# Altium project CCZynq.PrjPCB (part 2 of 4)

## Sheet ZYNQ_DDR3.SchDoc: DDR3
size 431 x 279 mm
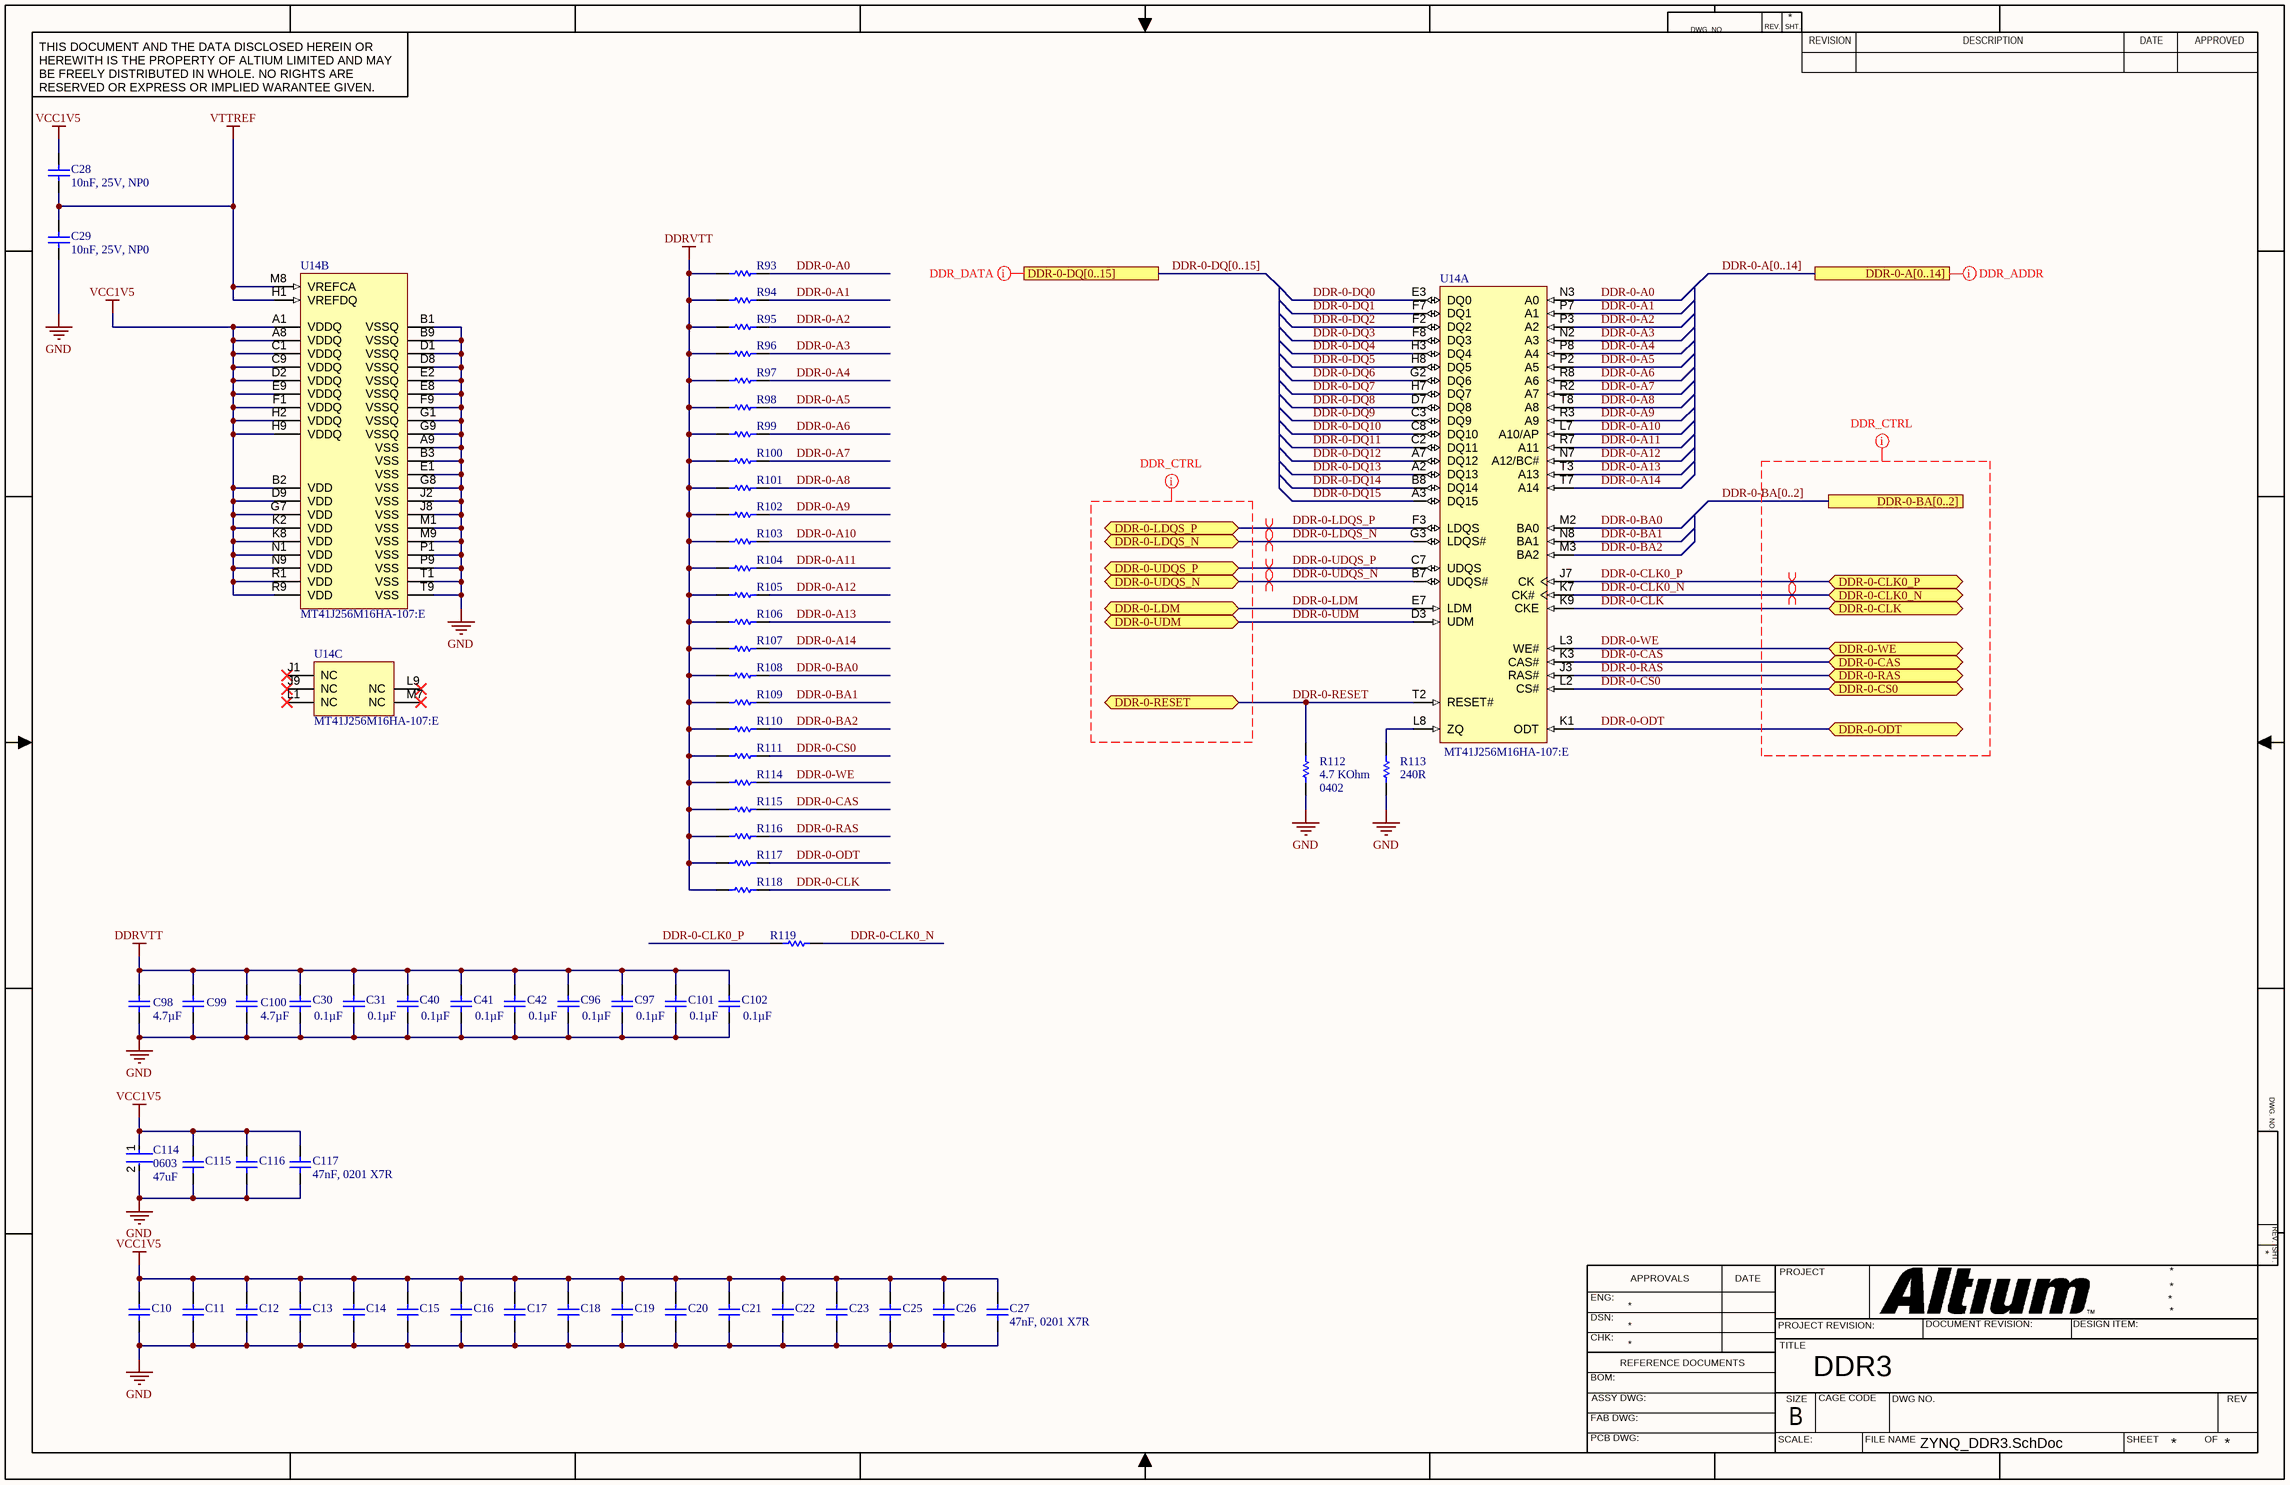
[diagram p4: ZYNQ_DDR3.SchDoc]

### Parts
C10  (no value)  [CAP0201i]
C11  (no value)  [CAP0201i]
C12  (no value)  [CAP0201i]
C13  (no value)  [CAP0201i]
C14  (no value)  [CAP0201i]
C15  (no value)  [CAP0201i]
C16  (no value)  [CAP0201i]
C17  (no value)  [CAP0201i]
C18  (no value)  [CAP0201i]
C19  (no value)  [CAP0201i]
C20  (no value)  [CAP0201i]
C21  (no value)  [CAP0201i]
C22  (no value)  [CAP0201i]
C23  (no value)  [CAP0201i]
C25  (no value)  [CAP0201i]
C26  (no value)  [CAP0201i]
C27  value 47nF, 0201 X7R  [CAP0201i]
C28  value 10nF, 25V, NP0  [CAP0402i]  (hidden comment: 10nF)
C29  value 10nF, 25V, NP0  [CAP0402i]  (hidden comment: 10nF)
C30  0.1µF  [CAP0402i]
C31  0.1µF  [CAP0402i]
C40  0.1µF  [CAP0402i]
C41  0.1µF  [CAP0402i]
C42  0.1µF  [CAP0402i]
C96  0.1µF  [CAP0402i]
C97  0.1µF  [CAP0402i]
C98  4.7µF  [CAP0402i]
C99  4.7µF  [CAP0402i]  (value not drawn)
C100  4.7µF  [CAP0402i]
C101  0.1µF  [CAP0402i]
C102  0.1µF  [CAP0402i]
C114  Case Code (Imperial): 0603  Capacitance: 47uF  [FP-GRM188-0_2-IPC_B]  (hidden comment: GRM188R60J476ME15D)
C115  4.7µF  [CAP0402i]  (value not drawn)
C116  (no value)  [CAP0201i]
C117  value 47nF, 0201 X7R  [CAP0201i]
R93  ERJ2RKF33R0X  [RESC1005X40X25LL05T05]  (value not drawn)
R94  ERJ2RKF33R0X  [RESC1005X40X25LL05T05]  (value not drawn)
R95  ERJ2RKF33R0X  [RESC1005X40X25LL05T05]  (value not drawn)
R96  ERJ2RKF33R0X  [RESC1005X40X25LL05T05]  (value not drawn)
R97  ERJ2RKF33R0X  [RESC1005X40X25LL05T05]  (value not drawn)
R98  ERJ2RKF33R0X  [RESC1005X40X25LL05T05]  (value not drawn)
R99  ERJ2RKF33R0X  [RESC1005X40X25LL05T05]  (value not drawn)
R100  ERJ2RKF33R0X  [RESC1005X40X25LL05T05]  (value not drawn)
R101  ERJ2RKF33R0X  [RESC1005X40X25LL05T05]  (value not drawn)
R102  ERJ2RKF33R0X  [RESC1005X40X25LL05T05]  (value not drawn)
R103  ERJ2RKF33R0X  [RESC1005X40X25LL05T05]  (value not drawn)
R104  ERJ2RKF33R0X  [RESC1005X40X25LL05T05]  (value not drawn)
R105  ERJ2RKF33R0X  [RESC1005X40X25LL05T05]  (value not drawn)
R106  ERJ2RKF33R0X  [RESC1005X40X25LL05T05]  (value not drawn)
R107  ERJ2RKF33R0X  [RESC1005X40X25LL05T05]  (value not drawn)
R108  ERJ2RKF33R0X  [RESC1005X40X25LL05T05]  (value not drawn)
R109  ERJ2RKF33R0X  [RESC1005X40X25LL05T05]  (value not drawn)
R110  ERJ2RKF33R0X  [RESC1005X40X25LL05T05]  (value not drawn)
R111  ERJ2RKF33R0X  [RESC1005X40X25LL05T05]  (value not drawn)
R112  Resistance: 4.7 KOhm  PackageReference: 0402  [RESC1005X40X25LL05T05]  (hidden comment: ERJ-2RKF4701X)
R113  value 240R  [RESC1005X40X25ML05T05]  (hidden comment: CRCW0402240RFKED)
R114  ERJ2RKF33R0X  [RESC1005X40X25LL05T05]  (value not drawn)
R115  ERJ2RKF33R0X  [RESC1005X40X25LL05T05]  (value not drawn)
R116  ERJ2RKF33R0X  [RESC1005X40X25LL05T05]  (value not drawn)
R117  ERJ2RKF33R0X  [RESC1005X40X25LL05T05]  (value not drawn)
R118  ERJ2RKF33R0X  [RESC1005X40X25LL05T05]  (value not drawn)
R119  CRCW040282R0FKED  [RESC1005X40X25NL05T05]  (value not drawn)
U14  MT41J256M16HA-107:E  [MICT-HA-96]  (parts A,B,C of 3)

### Ports
DDR-0-A[0..14], DDR-0-BA[0..2], DDR-0-CAS (bidir), DDR-0-CLK0_N (bidir), DDR-0-CLK0_P (bidir), DDR-0-CLK (bidir), DDR-0-CS0 (bidir), DDR-0-DQ[0..15], DDR-0-LDM (bidir), DDR-0-LDQS_N (bidir), DDR-0-LDQS_P (bidir), DDR-0-ODT (bidir), DDR-0-RAS (bidir), DDR-0-RESET (bidir), DDR-0-UDM (bidir), DDR-0-UDQS_N (bidir), DDR-0-UDQS_P (bidir), DDR-0-WE (bidir)

### Nets
DDRVTT: C30.2 C31.2 C40.2 C41.2 C42.2 C96.2 C97.2 C98.2 C99.2 C100.2 C101.2 C102.2 R93.1 R94.1 R95.1 R96.1 R97.1 R98.1 R99.1 R100.1 R101.1 R102.1 R103.1 R104.1 R105.1 R106.1 R107.1 R108.1 R109.1 R110.1 R111.1 R114.1 R115.1 R116.1 R117.1 R118.1
GND: C10.1 C11.1 C12.1 C13.1 C14.1 C15.1 C16.1 C17.1 C18.1 C19.1 C20.1 C21.1 C22.1 C23.1 C25.1 C26.1 C27.1 C29.1 C30.1 C31.1 C40.1 C41.1 C42.1 C96.1 C97.1 C98.1 C99.1 C100.1 C101.1 C102.1 C114.2 C115.1 C116.1 C117.2 R112.1 R113.1 U14.A9(VSS) U14.B1(VSSQ) U14.B3(VSS) U14.B9(VSSQ) U14.D1(VSSQ) U14.D8(VSSQ) U14.E1(VSS) U14.E2(VSSQ) U14.E8(VSSQ) U14.F9(VSSQ) U14.G1(VSSQ) U14.G8(VSS) U14.G9(VSSQ) U14.J2(VSS) U14.J8(VSS) U14.M1(VSS) U14.M9(VSS) U14.P1(VSS) U14.P9(VSS) U14.T1(VSS) U14.T9(VSS)
VCC1V5: C10.2 C11.2 C12.2 C13.2 C14.2 C15.2 C16.2 C17.2 C18.2 C19.2 C20.2 C21.2 C22.2 C23.2 C25.2 C26.2 C27.2 C28.2 C114.1 C115.2 C116.2 C117.1 U14.A1(VDDQ) U14.A8(VDDQ) U14.B2(VDD) U14.C1(VDDQ) U14.C9(VDDQ) U14.D2(VDDQ) U14.D9(VDD) U14.E9(VDDQ) U14.F1(VDDQ) U14.G7(VDD) U14.H2(VDDQ) U14.H9(VDDQ) U14.K2(VDD) U14.K8(VDD) U14.N1(VDD) U14.N9(VDD) U14.R1(VDD) U14.R9(VDD)
VTTREF: C28.1 C29.2 U14.H1(VREFDQ) U14.M8(VREFCA)
DDR-0-A0: R93.2 U14.N3(A0)
DDR-0-A1: R94.2 U14.P7(A1)
DDR-0-A2: R95.2 U14.P3(A2)
DDR-0-A3: R96.2 U14.N2(A3)
DDR-0-A4: R97.2 U14.P8(A4)
DDR-0-A5: R98.2 U14.P2(A5)
DDR-0-A6: R99.2 U14.R8(A6)
DDR-0-A7: R100.2 U14.R2(A7)
DDR-0-A8: R101.2 U14.T8(A8)
DDR-0-A9: R102.2 U14.R3(A9)
DDR-0-A10: R103.2 U14.L7(A10/AP)
DDR-0-A11: R104.2 U14.R7(A11)
DDR-0-A12: R105.2 U14.N7(A12/BC#)
DDR-0-A13: R106.2 U14.T3(A13)
DDR-0-A14: R107.2 U14.T7(A14)
DDR-0-BA0: R108.2 U14.M2(BA0)
DDR-0-BA1: R109.2 U14.N8(BA1)
DDR-0-BA2: R110.2 U14.M3(BA2)
DDR-0-CAS: R115.2 U14.K3(CAS#) ; port DDR-0-CAS
DDR-0-CLK: R118.2 U14.K9(CKE) ; port DDR-0-CLK
DDR-0-CLK0_N: R119.2 U14.K7(CK#) ; port DDR-0-CLK0_N
DDR-0-CLK0_P: R119.1 U14.J7(CK) ; port DDR-0-CLK0_P
DDR-0-CS0: R111.2 U14.L2(CS#) ; port DDR-0-CS0
DDR-0-DQ0: U14.E3(DQ0)
DDR-0-DQ1: U14.F7(DQ1)
DDR-0-DQ2: U14.F2(DQ2)
DDR-0-DQ3: U14.F8(DQ3)
DDR-0-DQ4: U14.H3(DQ4)
DDR-0-DQ5: U14.H8(DQ5)
DDR-0-DQ6: U14.G2(DQ6)
DDR-0-DQ7: U14.H7(DQ7)
DDR-0-DQ8: U14.D7(DQ8)
DDR-0-DQ9: U14.C3(DQ9)
DDR-0-DQ10: U14.C8(DQ10)
DDR-0-DQ11: U14.C2(DQ11)
DDR-0-DQ12: U14.A7(DQ12)
DDR-0-DQ13: U14.A2(DQ13)
DDR-0-DQ14: U14.B8(DQ14)
DDR-0-DQ15: U14.A3(DQ15)
DDR-0-LDM: U14.E7(LDM) ; port DDR-0-LDM
DDR-0-LDQS_N: U14.G3(LDQS#) ; port DDR-0-LDQS_N
DDR-0-LDQS_P: U14.F3(LDQS) ; port DDR-0-LDQS_P
DDR-0-ODT: R117.2 U14.K1(ODT) ; port DDR-0-ODT
DDR-0-RAS: R116.2 U14.J3(RAS#) ; port DDR-0-RAS
DDR-0-RESET: R112.2 U14.T2(RESET#) ; port DDR-0-RESET
DDR-0-UDM: U14.D3(UDM) ; port DDR-0-UDM
DDR-0-UDQS_N: U14.B7(UDQS#) ; port DDR-0-UDQS_N
DDR-0-UDQS_P: U14.C7(UDQS) ; port DDR-0-UDQS_P
DDR-0-WE: R114.2 U14.L3(WE#) ; port DDR-0-WE
NetR113_2: R113.2 U14.L8(ZQ)

Not connected (* = marked no-connect by the designer): U14 J1(NC)* J9(NC)* L1(NC)* L9(NC)* M7(NC)*

### Buses and harness runs
bus DDR-0-A[0..14] = port DDR-0-A[0..14]
bus DDR-0-BA[0..2] = port DDR-0-BA[0..2]
bus DDR-0-DQ[0..15] = port DDR-0-DQ[0..15]

### Layout directives
differential pair: DDR-0-CLK0_N, DDR-0-CLK0_P, DDR-0-LDQS_N, DDR-0-LDQS_P, DDR-0-UDQS_N, DDR-0-UDQS_P
net class DDR_DATA; rule Width Constraint [Pref Width = 0.1mm    Min Width = 0.1mm    Max Width = 0.254mm]; rule Impedance Constraint [Min = 49.99    Max = 50.00    ]: (no net found under the mark)
net class DDR_CTRL; rule Width Constraint [Pref Width = 0.1mm    Min Width = 0.1mm    Max Width = 0.254mm]; rule Impedance Constraint [Min = 49.99    Max = 50.99    ]; rule Length Constraint [Min Length = 0mil    Max Length = 2000mil]: (no net found under the mark)

### Notes on the sheet
- DWG. NO.
- REV.
- SHT.
- THIS DOCUMENT AND THE DATA DISCLOSED HEREIN OR HEREWITH IS THE PROPERTY OF ALTIUM LIMITED AND MAY BE FREELY DISTRIBUTED IN WHOLE. NO RIGHTS ARE RESERVED OR EXPRESS OR IMPLIED WARANTEE GIVEN.
- REVISION
- DESCRIPTION
- DATE
- APPROVED
- ENG:
- APPROVALS
- PROJECT
- DSN:
- CHK:
- REFERENCE DOCUMENTS
- PROJECT REVISION:
- TITLE
- DOCUMENT REVISION:
- DESIGN ITEM:
- BOM:
- FAB DWG:
- PCB DWG:
- ASSY DWG:
- SCALE:
- SIZE
- B
- CAGE CODE
- FILE NAME
- DWG NO.
- SHEET
- OF
- REV

### Library data of the parts
C10-C23 C25 C26 C116 = Cap_47nF_X7R_0201: 0201, 47nF, 10%, 25V, X7R; Value: 47nF, 0201 X7R; Mounting Type: SMT; Package: 0201; Applications: Automotive; Ratings: AEC-Q200; Component Type: Generic; Capacitance: 47nF; Note: *; Supplier 1: Arrow Electronics; Supplier Part Number 1: GRM033R61A473KE84D; Supplier 2: Future Electronics; Supplier Part Number 2: 4125905; Supplier 3: Farnell; Supplier Part Number 3: 3340765; Supplier 4: Mouser; Supplier Part Number 4: 81-GRM033R61A473KE4D; Supplier 5: Digikey; Supplier Part Number 5: 490-14570-1-ND; Supplier 6: Newark; Supplier Part Number 6: 77AH4496
C27 C117 = Cap_47nF_X7R_0201: 0201, 47nF, 10%, 25V, X7R; Mounting Type: SMT; Package: 0201; Applications: Automotive; Ratings: AEC-Q200; Component Type: Generic; Capacitance: 47nF; Note: *; Supplier 1: Arrow Electronics; Supplier Part Number 1: GRM033R61A473KE84D; Supplier 2: Future Electronics; Supplier Part Number 2: 4125905; Supplier 3: Farnell; Supplier Part Number 3: 3340765; Supplier 4: Mouser; Supplier Part Number 4: 81-GRM033R61A473KE4D; Supplier 5: Digikey; Supplier Part Number 5: 490-14570-1-ND; Supplier 6: Newark; Supplier Part Number 6: 77AH4496
C28 C29 = Cap_10nF_25V_NP0_0402: 0402,10nF,5%,25V,NP0; Part Number: GRM1555C1E103JE01J; Manufacturer: Murata; Type: Ceramic; Voltage: 25V; Temperature Coefficient: NP0; Tolerance: ±5%; Operating Temperature: -55°C ~ 125°C; Mounting Type: SMT; Package: 0402 (1005 Metric); Supplier 1: Mouser; Supplier Part Number 1: 81-GRM1555C1E103JE1J; Manufacturer Part Number 1: GRM1555C1E103JE01J; Component Type: Generic; Capacitance: 10nF; Note: *; Supplier 2: DigiKey; Supplier 3: Farnell; Supplier Part Number 2: *; Supplier Part Number 3: *
C30 C31 C40-C42 C96 C97 C101 C102 = Cap_0.1uF_50V_X7R_0402: 0402, 0.1uF, 10%,  50V, X7R; Part Number: C1005X7R1H104K050BE; Manufacturer 1: TDK; Type: Ceramic; Value: 0.1µF,50V,X7R; Voltage: 50V; Temperature Coefficient: X7R; Tolerance: ±10%; Operating Temperature: -55°C ~ 125°C; Mounting Type: SMT; Package: 0402 (1005 Metric); Applications: Automotive; Ratings: AEC-Q200; Supplier 1: Mouser; Supplier Part Number 1: 810-C1005X7R1H104KBE; Manufacturer Part Number 1: C1005X7R1H104K050BE; Component Type: Generic; Capacitance: 0.1µF; Note: *; Supplier 2: DigiKey; Supplier 3: Farnell; Supplier Part Number 2: 445-173610-1-ND; Supplier Part Number 3: 3416071
C98-C100 C115 = Cap_4.7uF_10V_10%_0402: CAP CER 4.7UF 10V X5R 0402; Part Number: C1005X5R1A475K050BC; Manufacturer 1: TDK; Value: 4.7µF, 10V, X5R; Tolerance: 10%; Dielectric Material: Ceramic; RoHS: Yes; Lead Free: Lead Free; ComponentLink2Description: https://datasheet.ciiva.com/14895/tdkmlcccaprange-14895670.pdf?src-supplier=Digi-Key; ComponentLink2URL: https://datasheet.ciiva.com/14895/tdkmlcccaprange-14895670.pdf?src-supplier=Digi-Key; Category: Ceramic Capacitors; Capacitance: 4.7µF; Voltage Rating: 10V; Supplier 1: Mouser; Manufacturer Part Number 1: C1005X5R1A475K050BC; Stock 1: 1272492; Mount: Surface Mount; Case/Package: 0402; Case Code (Metric): 1005; Case Code (Imperial): 0402; Min Operating Temperature: -55°C; Max Operating Temperature: 85°C; Package Quantity: 10000; Packaging: Cut Tape; Voltage Rating (DC): 10V; Series: C; Dielectric: X5R; Length: 0.039inch; Width: 0.02inch; Thickness: 0.022inch; RoHS Compliant: Yes; Reach SVHC Compliant: Yes; ComponentLink1URL: https://datasheet.ciiva.com/14895/tdkmlcccaprange-14895671.pdf?src-supplier=Digi-Key; ComponentLink1Description: https://datasheet.ciiva.com/14895/tdkmlcccaprange-14895671.pdf?src-supplier=Digi-Key; ComponentLink3URL: https://datasheet.ciiva.com/14895/tdkmlcccaprange-14895672.pdf?src-supplier=Digi-Key; ComponentLink3Description: https://datasheet.ciiva.com/14895/tdkmlcccaprange-14895672.pdf?src-supplier=Digi-Key; Supplier Part Number 1: 810-C1005X5R1A475KBC; Component Type: Generic
C114 = CMP-2000-05444-2: Chip Multilayer Ceramic Capacitors for General Purpose, 0603, 47uF, X5R, 15%, 20%, 6.3V; Voltage Rating (DC): 6.3V; Thickness: 0.039inch; Packaging: Tape and Reel; Width: 0.031inch; Dielectric: X5R; Max Operating Temperature: 85°C; Mount: Surface Mount; Case Code (Metric): 1608; Length: 0.063inch; Voltage Rating: 6.3V; Tolerance: 20%; Case/Package: 0603; Min Operating Temperature: -55°C
R93-R111 R114-R118 = CMP-2002-01146-1: Manufacturer: Panasonic; Part Number: ERJ2RKF33R0X
R112 = CMP-2002-01154-4: Chip Resistor, 4.7 KOhm, +/- 1%, 0.1 W, -55 to 155 degC, 0402 (1005 Metric), RoHS, Tape and Reel; Voltage Rating: 50 V; Power Rating: 100 mW; Height: 0.35 mm; Mounting Technology: Surface Mount; REACH SVHC: Yes; Max Operating Temperature: 155 degC; ComponentLink1Description: Manufacturer URL; ComponentLink2Description: Datasheet; Pins: 2; Tolerance: 1%; Case Code (Imperial): 0402; Length: 1 mm; PackageDescription: 2-Pin Surface Mount Device, Body 1 x 0.5 mm; PartNumber: ERJ-2RKF4701X; RoHSCompliant: true; Package Quantity: 1; Radiation Hardening: No; DatasheetVersion: 04/2015; Width: 0.5 mm; Case Code (Metric): 1005; Case\/Package: 0402; Mount: Surface Mount; ComponentLink1URL: http://www.panasonic.com/; Min Operating Temperature: -55 degC; Packaging: Cut Tape; ComponentLink2URL: http://industrial.panasonic.com/cdbs/www-data/pdf/RDA0000/AOA0000C86.pdf
R113 = CMP-2002-08397-1: Manufacturer: Vishay Dale; Description: SMD Chip Resistor, 240 Ohm, ± 1%, 63 mW, 0402 [1005 Metric], Thick Film, General Purpose; Part Number: CRCW0402240RFKED; Supplier: Mouser; Supplier Part Number: 71-CRCW0402240RFKED; Manufacturer Part Number: CRCW0402240RFKED; RoHS: Yes; Category: Chip SMD Resistors; Stock: 394314; ComponentLink1URL: https://datasheet.ciiva.com/11809/0900766b80d98824-11809853.pdf?src-supplier=Rs; ComponentLink1Description: https://datasheet.ciiva.com/11809/0900766b80d98824-11809853.pdf?src-supplier=Rs; ComponentLink2URL: https://datasheet.ciiva.com/2463/dcrcwe3-2463067.pdf?src-supplier=Digikey; ComponentLink2Description: https://datasheet.ciiva.com/2463/dcrcwe3-2463067.pdf?src-supplier=Digikey; ComponentLink3URL: https://datasheet.ciiva.com/2463/dcrcwe3-2463068.pdf?src-supplier=Digikey; ComponentLink3Description: https://datasheet.ciiva.com/2463/dcrcwe3-2463068.pdf?src-supplier=Digikey; ComponentLink4URL: https://datasheet.ciiva.com/2463/dcrcwe3-2463069.pdf?src-supplier=Digikey; ComponentLink4Description: https://datasheet.ciiva.com/2463/dcrcwe3-2463069.pdf?src-supplier=Digikey; ComponentLink5URL: https://datasheet.ciiva.com/16780/70201119-16780206.pdf?src-supplier=Allied+Electronics; ComponentLink5Description: https://datasheet.ciiva.com/16780/70201119-16780206.pdf?src-supplier=Allied+Electronics; ComponentLink6URL: https://datasheet.ciiva.com/16784/70201119-16784686.pdf?src-supplier=Allied+Electronics; ComponentLink6Description: https://datasheet.ciiva.com/16784/70201119-16784686.pdf?src-supplier=Allied+Electronics; ComponentLink7URL: https://datasheet.ciiva.com/16204/dcrcwe3-16204941.pdf?src-supplier=Future+Electronics; ComponentLink7Description: https://datasheet.ciiva.com/16204/dcrcwe3-16204941.pdf?src-supplier=Future+Electronics; ComponentLink8URL: https://datasheet.ciiva.com/5546/dcrcwe3-109170-5546510.pdf?src-supplier=Mouser; ComponentLink8Description: https://datasheet.ciiva.com/5546/dcrcwe3-109170-5546510.pdf?src-supplier=Mouser
R119 = CMP-2002-00238-1: Manufacturer: Vishay Dale; Part Number: CRCW040282R0FKED
U14 = CMP-2000-06768-1: 4Gb DDR3 SDRAM, 256 Meg x 16, 1.5 V, 0 to 95 degC, 96-Ball FBGA (HA), RoHS, Tray; Manufacturer: Micron; Voltage - Supply: 1.425V~1.575V; Speed: 933MHz; Interface: Parallel; Format - Memory: RAM; Memory Size: 4G(256Mx16); Standard Package: 1,000; Packaging: Tray; Family: Memory; Mounting Technology: SurfaceMount; Operating Temperature: 0°C~95°C; Memory Type: DDR3SDRAM; Manufacturer URL: http://www.micron.com/; Datasheet URL: https://www.micron.com/~/media/documents/products/data-sheet/dram/ddr3/4gb_ddr3_sdram.pdf; Category: IntegratedCircuits(ICs); Datasheet Version: Rev. N, 12/2014; Package / Case: 96-TFBGA; Supplier Device Package: 96-FBGA(9x14); Package Reference: HA-96; Package Description: 96-Ball Fine-Pitch Ball Grid Array, Body 14 x 9 mm, Pitch 0.8 mm

## Sheet ZYNQ_PW.SchDoc: SqueakyBoard
size 431 x 279 mm
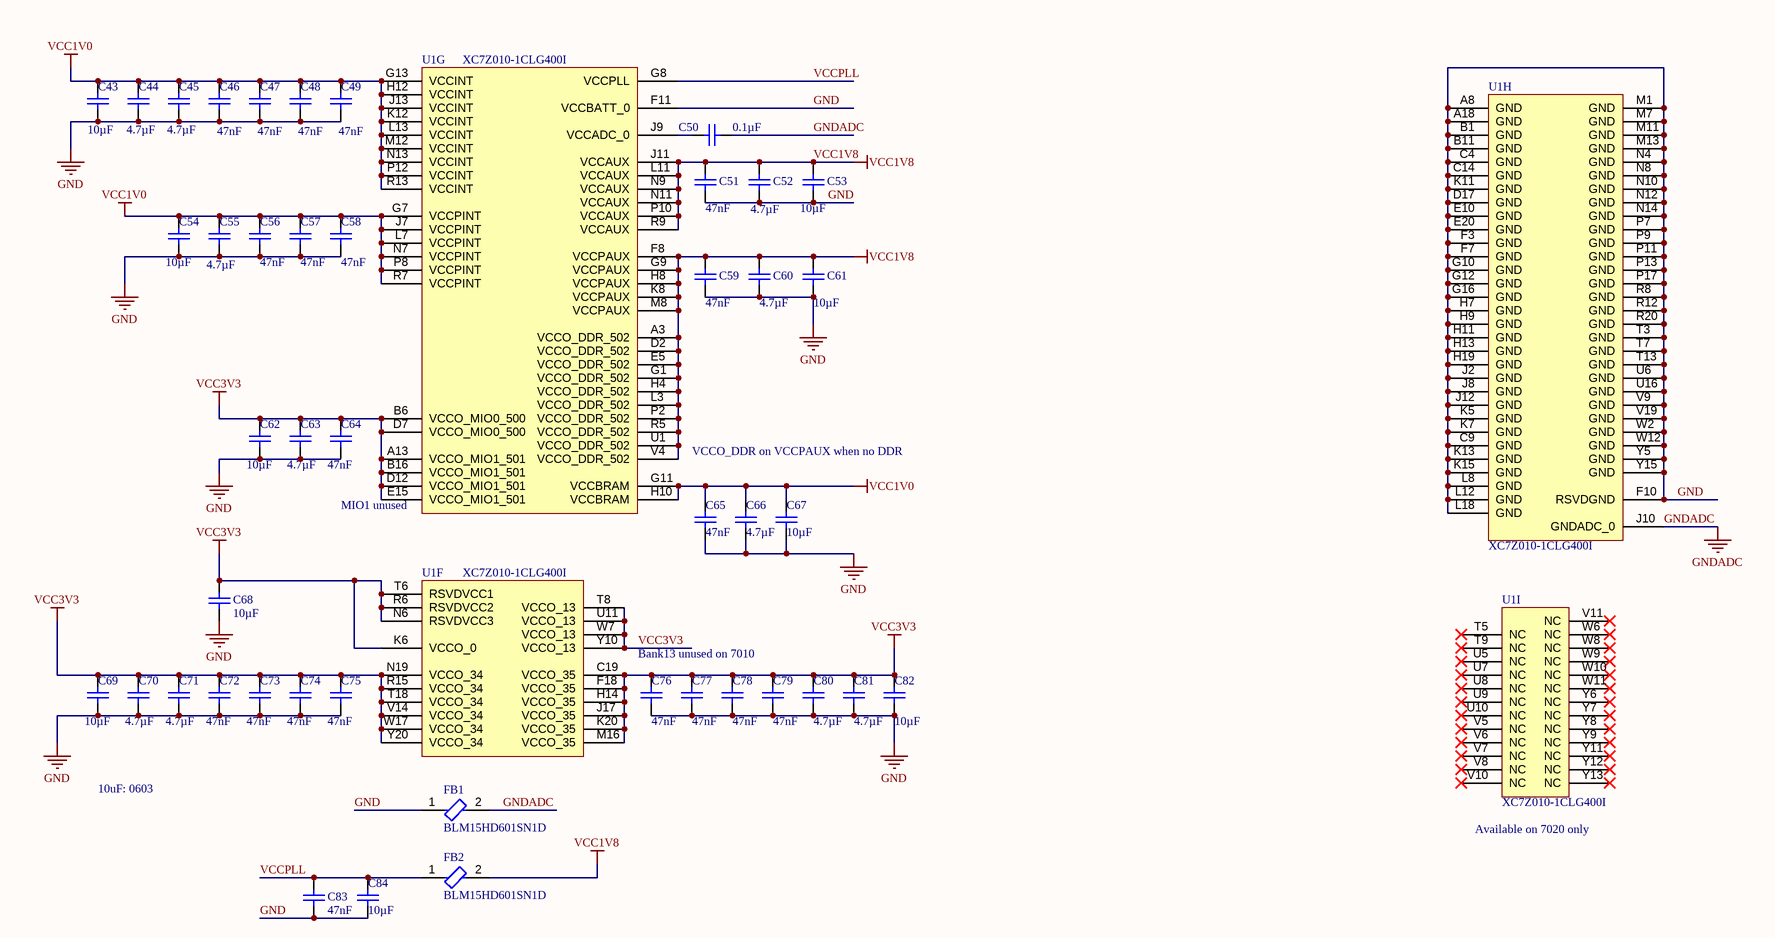
[diagram p5: ZYNQ_PW.SchDoc]

### Parts
C43  10µF  [CAP0805i]
C44  4.7µF  [CAP0402i]
C45  4.7µF  [CAP0402i]
C46  Capacitance: 47nF  [CAP0201i]
C47  Capacitance: 47nF  [CAP0201i]
C48  Capacitance: 47nF  [CAP0201i]
C49  Capacitance: 47nF  [CAP0201i]
C50  0.1µF  [CAP0402i]
C51  Capacitance: 47nF  [CAP0201i]
C52  4.7µF  [CAP0402i]
C53  10µF  [CAP0805i]
C54  10µF  [CAP0805i]
C55  4.7µF  [CAP0402i]
C56  Capacitance: 47nF  [CAP0201i]
C57  Capacitance: 47nF  [CAP0201i]
C58  Capacitance: 47nF  [CAP0201i]
C59  Capacitance: 47nF  [CAP0201i]
C60  4.7µF  [CAP0402i]
C61  10µF  [CAP0805i]
C62  10µF  [CAP0805i]
C63  4.7µF  [CAP0402i]
C64  Capacitance: 47nF  [CAP0201i]
C65  Capacitance: 47nF  [CAP0201i]
C66  4.7µF  [CAP0402i]
C67  10µF  [CAP0805i]
C68  10µF  [CAP0805i]
C69  10µF  [CAP0805i]
C70  4.7µF  [CAP0402i]
C71  4.7µF  [CAP0402i]
C72  Capacitance: 47nF  [CAP0201i]
C73  Capacitance: 47nF  [CAP0201i]
C74  Capacitance: 47nF  [CAP0201i]
C75  Capacitance: 47nF  [CAP0201i]
C76  Capacitance: 47nF  [CAP0201i]
C77  Capacitance: 47nF  [CAP0201i]
C78  Capacitance: 47nF  [CAP0201i]
C79  Capacitance: 47nF  [CAP0201i]
C80  4.7µF  [CAP0402i]
C81  4.7µF  [CAP0402i]  (value not drawn)
C82  10µF  [CAP0805i]
C83  Capacitance: 47nF  [CAP0201i]
C84  10µF  [CAP0805i]
FB1  BLM15HD601SN1D  [FP-BLM15-0_05-MFG]
FB2  BLM15HD601SN1D  [FP-BLM15-0_05-MFG]
U1  XC7Z010-1CLG400I  [CLG400]  (parts F,G,H,I of 9)

### Nets
GND: C43.2 C44.2 C45.2 C46.2 C47.2 C48.2 C49.2 C51.1 C52.1 C53.1 C54.2 C55.2 C56.2 C57.2 C58.2 C59.1 C60.1 C61.1 C62.2 C63.2 C64.2 C65.1 C66.1 C67.1 C68.1 C69.2 C70.2 C71.2 C72.2 C73.2 C74.2 C75.2 C76.2 C77.2 C78.2 C79.2 C80.2 C81.2 C82.2 C83.1 C84.2 FB1.1 U1.A8(GND) U1.A18(GND) U1.B1(GND) U1.B11(GND) U1.C4(GND) U1.C9(GND) U1.C14(GND) U1.D17(GND) U1.E10(GND) U1.E20(GND) U1.F3(GND) U1.F7(GND) U1.F10(RSVDGND) U1.F11(VCCBATT_0) U1.G10(GND) U1.G12(GND) U1.G16(GND) U1.H7(GND) U1.H9(GND) U1.H11(GND) U1.H13(GND) U1.H19(GND) U1.J2(GND) U1.J8(GND) U1.J12(GND) U1.K5(GND) U1.K7(GND) U1.K11(GND) U1.K13(GND) U1.K15(GND) U1.L8(GND) U1.L12(GND) U1.L18(GND) U1.M1(GND) U1.M7(GND) U1.M11(GND) U1.M13(GND) U1.N4(GND) U1.N8(GND) U1.N10(GND) U1.N12(GND) U1.N14(GND) U1.P7(GND) U1.P9(GND) U1.P11(GND) U1.P13(GND) U1.P17(GND) U1.R8(GND) U1.R12(GND) U1.R20(GND) U1.T3(GND) U1.T7(GND) U1.T13(GND) U1.U6(GND) U1.U16(GND) U1.V9(GND) U1.V19(GND) U1.W2(GND) U1.W12(GND) U1.Y5(GND) U1.Y15(GND)
GNDADC: C50.2 FB1.2 U1.J10(GNDADC_0)
VCC1V0: C43.1 C44.1 C45.1 C46.1 C47.1 C48.1 C49.1 C54.1 C55.1 C56.1 C57.1 C58.1 C65.2 C66.2 C67.2 U1.G7(VCCPINT) U1.G11(VCCBRAM) U1.G13(VCCINT) U1.H10(VCCBRAM) U1.H12(VCCINT) U1.J7(VCCPINT) U1.J13(VCCINT) U1.K12(VCCINT) U1.L7(VCCPINT) U1.L13(VCCINT) U1.M12(VCCINT) U1.N7(VCCPINT) U1.N13(VCCINT) U1.P8(VCCPINT) U1.P12(VCCINT) U1.R7(VCCPINT) U1.R13(VCCINT)
VCC1V8: C51.2 C52.2 C53.2 C59.2 C60.2 C61.2 FB2.2 U1.A3(VCCO_DDR_502) U1.D2(VCCO_DDR_502) U1.E5(VCCO_DDR_502) U1.F8(VCCPAUX) U1.G1(VCCO_DDR_502) U1.G9(VCCPAUX) U1.H4(VCCO_DDR_502) U1.H8(VCCPAUX) U1.J11(VCCAUX) U1.K8(VCCPAUX) U1.L3(VCCO_DDR_502) U1.L11(VCCAUX) U1.M8(VCCPAUX) U1.N9(VCCAUX) U1.N11(VCCAUX) U1.P2(VCCO_DDR_502) U1.P10(VCCAUX) U1.R5(VCCO_DDR_502) U1.R9(VCCAUX) U1.U1(VCCO_DDR_502) U1.V4(VCCO_DDR_502)
VCC3V3: C62.1 C63.1 C64.1 C68.2 C69.1 C70.1 C71.1 C72.1 C73.1 C74.1 C75.1 C76.1 C77.1 C78.1 C79.1 C80.1 C81.1 C82.1 U1.A13(VCCO_MIO1_501) U1.B6(VCCO_MIO0_500) U1.B16(VCCO_MIO1_501) U1.C19(VCCO_35) U1.D7(VCCO_MIO0_500) U1.D12(VCCO_MIO1_501) U1.E15(VCCO_MIO1_501) U1.F18(VCCO_35) U1.H14(VCCO_35) U1.J17(VCCO_35) U1.K6(VCCO_0) U1.K20(VCCO_35) U1.M16(VCCO_35) U1.N6(RSVDVCC3) U1.N19(VCCO_34) U1.R6(RSVDVCC2) U1.R15(VCCO_34) U1.T6(RSVDVCC1) U1.T8(VCCO_13) U1.T18(VCCO_34) U1.U11(VCCO_13) U1.V14(VCCO_34) U1.W7(VCCO_13) U1.W17(VCCO_34) U1.Y10(VCCO_13) U1.Y20(VCCO_34)
VCCPLL: C83.2 C84.1 FB2.1 U1.G8(VCCPLL)
NetC50_1: C50.1 U1.J9(VCCADC_0)

Not connected (* = marked no-connect by the designer): U1 T5(NC)* T9(NC)* U5(NC)* U7(NC)* U8(NC)* U9(NC)* U10(NC)* V5(NC)* V6(NC)* V7(NC)* V8(NC)* V10(NC)* V11(NC)* W6(NC)* W8(NC)* W9(NC)* W10(NC)* W11(NC)* Y6(NC)* Y7(NC)* Y8(NC)* Y9(NC)* Y11(NC)* Y12(NC)* Y13(NC)*

### Notes on the sheet
- VCCO_DDR on VCCPAUX when no DDR
- (near U1) MIO1 unused
- Bank13 unused on 7010
- 10uF: 0603
- (near U1) Available on 7020 only
- DWG. NO.
- REV.
- SHT.
- THIS DOCUMENT AND THE DATA DISCLOSED HEREIN OR HEREWITH IS THE PROPERTY OF ALTIUM LIMITED AND MAY BE FREELY DISTRIBUTED IN WHOLE. NO RIGHTS ARE RESERVED OR EXPRESS OR IMPLIED WARANTEE GIVEN.
- REVISION
- DESCRIPTION
- DATE
- APPROVED
- ENG:
- APPROVALS
- PROJECT
- DSN:
- CHK:
- REFERENCE DOCUMENTS
- PROJECT REVISION:
- TITLE
- DOCUMENT REVISION:
- DESIGN ITEM:
- BOM:
- FAB DWG:
- PCB DWG:
- ASSY DWG:
- SCALE:
- SIZE
- B
- CAGE CODE
- FILE NAME
- DWG NO.
- SHEET
- OF
- REV

### Library data of the parts
C43 C53 C54 C61 C62 C67-C69 C82 C84 = Cap_10uF_50V_X7S_0805: 0805, 10uF, 10%, 25V, X7S; Part Number: GRT21BC71E106KE13L; Manufacturer 1: Murata; Type: Ceramic; Value: 10µF,25V,X7S; Package: 0805 (2012 Metric); Voltage: 25V; Temperature Coefficient: X7S; Tolerance: ±10%; Operating Temperature: -55°C ~ 125°C; Mounting Type: SMT; Applications: Automotive; Ratings: AEC-Q200; Supplier 1: Mouser; Supplier Part Number 1: 81-GRT21BC71E106KE13; Manufacturer Part Number: GRT21BC71E106KE13L; Component Type: Generic; Capacitance: 10µF; Note: *; Supplier Part Number 2: 490-GRT21BC71E106KE13LCT-ND; Supplier Part Number 3: 3784584; Supplier 2: DigiKey; Supplier 3: Farnell; Manufacturer Part Number 1: GRT21BC71E106KE13L
C44 C45 C52 C55 C60 C63 C66 C70 C71 C80 C81 = Cap_4.7uF_10V_10%_0402: CAP CER 4.7UF 10V X5R 0402; Part Number: C1005X5R1A475K050BC; Manufacturer 1: TDK; Dielectric Material: Ceramic; Value: 4.7µF, 10V, X5R; Tolerance: 10%; ComponentLink1Description: https://datasheet.ciiva.com/14895/tdkmlcccaprange-14895671.pdf?src-supplier=Digi-Key; ComponentLink1URL: https://datasheet.ciiva.com/14895/tdkmlcccaprange-14895671.pdf?src-supplier=Digi-Key; Supplier 1: Mouser; Manufacturer Part Number 1: C1005X5R1A475K050BC; RoHS: Yes; Category: Ceramic Capacitors; Stock 1: 1272492; Mount: Surface Mount; Case/Package: 0402; Case Code (Metric): 1005; Case Code (Imperial): 0402; Min Operating Temperature: -55°C; Max Operating Temperature: 85°C; Package Quantity: 10000; Packaging: Cut Tape; Voltage Rating (DC): 10V; Series: C; Dielectric: X5R; Length: 0.039inch; Width: 0.02inch; Thickness: 0.022inch; Lead Free: Lead Free; RoHS Compliant: Yes; Reach SVHC Compliant: Yes; ComponentLink2URL: https://datasheet.ciiva.com/14895/tdkmlcccaprange-14895670.pdf?src-supplier=Digi-Key; ComponentLink2Description: https://datasheet.ciiva.com/14895/tdkmlcccaprange-14895670.pdf?src-supplier=Digi-Key; ComponentLink3URL: https://datasheet.ciiva.com/14895/tdkmlcccaprange-14895672.pdf?src-supplier=Digi-Key; ComponentLink3Description: https://datasheet.ciiva.com/14895/tdkmlcccaprange-14895672.pdf?src-supplier=Digi-Key; Supplier Part Number 1: 810-C1005X5R1A475KBC; Component Type: Generic; Capacitance: 4.7µF; Voltage Rating: 10V
C46-C49 C51 C56-C59 C64 C65 C72-C79 C83 = Cap_47nF_X7R_0201: as C10 on sheet ZYNQ_DDR3; Package: 0201; Mounting Type: SMT; Applications: Automotive; Ratings: AEC-Q200; Component Type: Generic; Note: *; Supplier 1: Arrow Electronics; Supplier 2: Future Electronics; Supplier 3: Farnell; Supplier 4: Mouser; Supplier 5: Digikey; Supplier 6: Newark; Supplier Part Number 1: GRM033R61A473KE84D; Supplier Part Number 2: 4125905; Supplier Part Number 3: 3340765; Supplier Part Number 4: 81-GRM033R61A473KE4D; Supplier Part Number 5: 490-14570-1-ND; Supplier Part Number 6: 77AH4496
C50 = Cap_0.1uF_50V_X7R_0402: as C30 on sheet ZYNQ_DDR3; Voltage: 50V; Temperature Coefficient: X7R; Tolerance: ±10%; Operating Temperature: -55°C ~ 125°C; Mounting Type: SMT; Package: 0402 (1005 Metric); Applications: Automotive; Ratings: AEC-Q200; Supplier 1: Mouser; Supplier Part Number 1: 810-C1005X7R1H104KBE; Manufacturer Part Number 1: C1005X7R1H104K050BE; Component Type: Generic; Capacitance: 0.1µF; Note: *; Supplier 2: DigiKey; Supplier 3: Farnell; Supplier Part Number 2: 445-173610-1-ND; Supplier Part Number 3: 3416071
FB1 FB2 = CMP-0686-00273-4: Chip Ferrite Bead, 0402, 600Ω @ 100MHz, 0.85Ω, 25%, 300mA; Impedance: 600R; DC Resistance-Max: 850mR; Shielding: Unshielded; Number of Circuits: 1; Core Material: Ferrite; Case Code (Metric): 1005; Case Code (Imperial): 0402; Depth: 0.5mm; Termination: SMD/SMT; Test Frequency: 100MHz; Lead Free: Lead Free; Width: 0.5mm; REACH SVHC: No SVHC; Min Operating Temperature: -55°C; Max Operating Temperature: 125°C; DC Resistance (DCR): 850mR; DC Current: 300mA; Max Current Rating: 300mA; Packaging: Tape and Reel; Radiation Hardening: No; Number of Lines: 1; Height: 0.5mm; Military Standard: Not; Number of Pins: 2; Frequency: 100MHz; Max DC Current: 300mA; Tolerance: 25%; Package Quantity: 1; Series: BLM15H; Length: 1mm; Case/Package: 0402; Material: Ferrite; Current Rating: 300mA
U1 = XC7Z010-1CLG400I: 667 MHz Zynq?7000 AP SoC, 130 PS I/O, 100 FPGA I/O, 400-Ball BGA, Speed Grade 1, Industrial Grade, Pb-Free; Manufacturer: Xilinx; Extensible Block RAM (# 36Kb Blocks): 240 KB (60); Flip Flops: 35200; LUTs: 17600; Speed Grade: -1; DatasheetVersion: v1.2; PackageVersion: Rev 1.1; PackageReference: CLG400; PackageDescription: Wire-Bond Chip-Scale BGA, Body 17 x 17 mm, 0.8 mm Pitch; Generic Part Number: XC7Z010; RoHS: Pb-Free; Mounting Technology: Surface Mount; Code_JEDEC: MO-275-MMAA-1; PartNumber: XC7Z010-1CLG400I; ComponentLink1Description: Datasheet; ComponentLink1URL: http://www.xilinx.com/support/documentation/data_sheets/ds190-Zynq-7000-Overview.pdf; ComponentLink2Description: Package Specification; ComponentLink2URL: http://www.xilinx.com/support/documentation/user_guides/ug865-Zynq-7000-Pkg-Pinout.pdf; ComponentLink3Description: DC and AC Switching Characteristics; ComponentLink3URL: http://www.xilinx.com/support/documentation/data_sheets/ds187-XC7Z010-XC7Z020-Data-Sheet.pdf; ComponentLink4Description: Package File; ComponentLink4URL: http://www.xilinx.com/support/packagefiles/z7packages/xc7z010clg400pkg.txt; ComponentLink5Description: Packaging and Pinout; ComponentLink5URL: http://www.xilinx.com/support/documentation/user_guides/ug865-Zynq-7000-Pkg-Pinout.pdf; ComponentLink6Description: PCB and Layout Guide; ComponentLink6URL: http://www.xilinx.com/support/documentation/user_guides/ug483_7Series_PCB.pdf